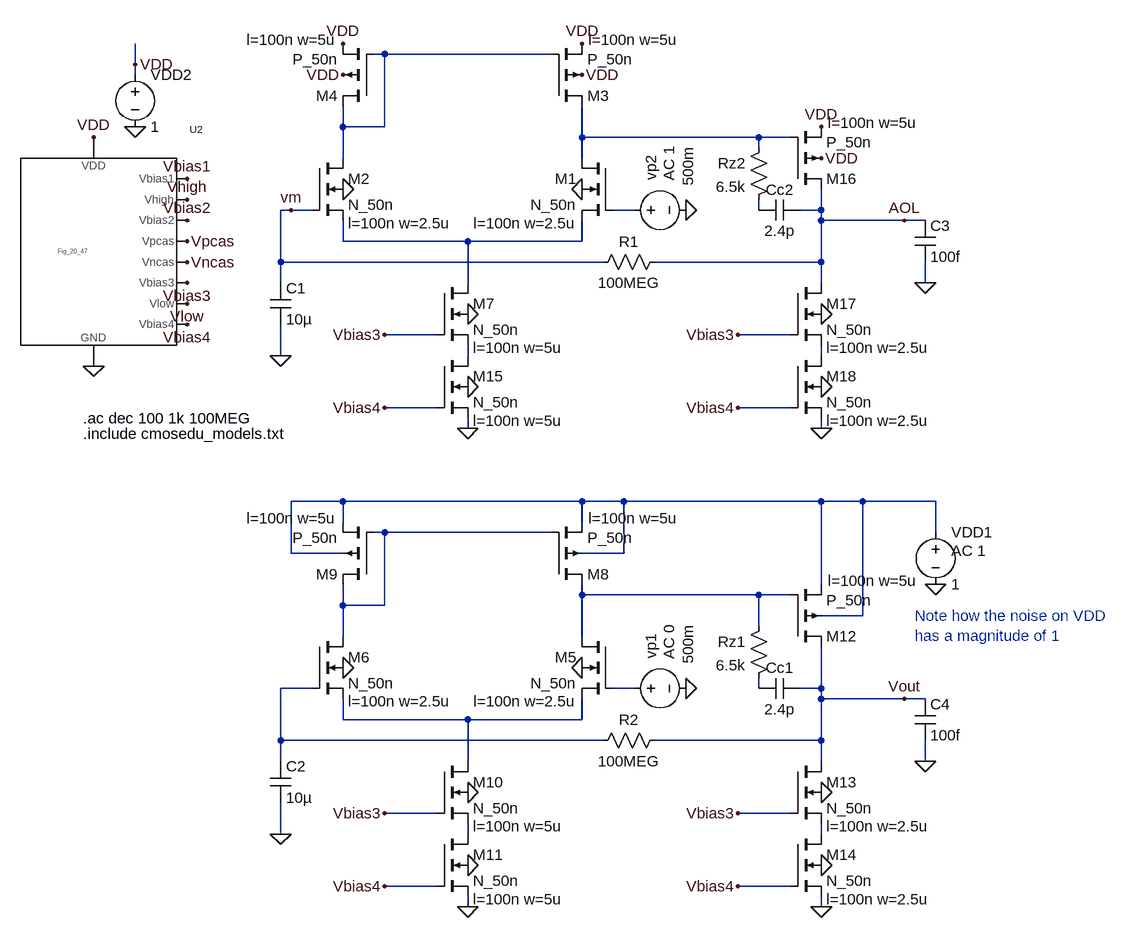
[diagram p0: schematic Fig24_27_PSRR_plus.asc]
Fig24_27_PSRR_plus.asc, the LTspice schematic file:
Version 4
SHEET 1 2512 680
WIRE 1280 -1024 1264 -1024
WIRE 1536 -1024 1280 -1024
WIRE 896 -1008 896 -1040
WIRE 896 -992 896 -1008
WIRE 1216 -912 1216 -944
WIRE 1280 -912 1280 -1024
WIRE 1280 -912 1216 -912
WIRE 1584 -896 1584 -944
WIRE 1856 -896 1584 -896
WIRE 1904 -896 1856 -896
WIRE 1856 -880 1856 -896
WIRE 1216 -864 1216 -912
WIRE 1584 -864 1584 -896
WIRE 1136 -784 1120 -784
WIRE 1168 -784 1136 -784
WIRE 1664 -784 1632 -784
WIRE 1856 -784 1856 -800
WIRE 1952 -784 1952 -816
WIRE 1952 -784 1920 -784
WIRE 1952 -768 1952 -784
WIRE 2080 -768 1952 -768
WIRE 2112 -768 2080 -768
WIRE 1216 -736 1216 -768
WIRE 1408 -736 1216 -736
WIRE 1584 -736 1584 -768
WIRE 1584 -736 1408 -736
WIRE 1120 -704 1120 -784
WIRE 1616 -704 1120 -704
WIRE 1952 -704 1952 -768
WIRE 1952 -704 1696 -704
WIRE 1120 -672 1120 -704
WIRE 1408 -672 1408 -736
WIRE 1952 -672 1952 -704
WIRE 2112 -672 2112 -704
WIRE 1360 -592 1280 -592
WIRE 1904 -592 1824 -592
WIRE 1120 -560 1120 -608
WIRE 1408 -560 1408 -576
WIRE 1952 -560 1952 -576
WIRE 1360 -480 1280 -480
WIRE 1904 -480 1824 -480
WIRE 1408 -448 1408 -464
WIRE 1952 -448 1952 -464
WIRE 1216 -336 1136 -336
WIRE 1584 -336 1216 -336
WIRE 1648 -336 1584 -336
WIRE 1952 -336 1648 -336
WIRE 2016 -336 1952 -336
WIRE 2128 -336 2016 -336
WIRE 1216 -304 1216 -336
WIRE 1584 -304 1584 -336
WIRE 1280 -288 1264 -288
WIRE 1536 -288 1280 -288
WIRE 2128 -288 2128 -336
WIRE 1136 -256 1136 -336
WIRE 1216 -256 1136 -256
WIRE 1648 -256 1648 -336
WIRE 1648 -256 1584 -256
WIRE 1952 -208 1952 -336
WIRE 1584 -192 1584 -208
WIRE 1856 -192 1584 -192
WIRE 1904 -192 1856 -192
WIRE 1216 -176 1216 -208
WIRE 1280 -176 1280 -288
WIRE 1280 -176 1216 -176
WIRE 2016 -160 2016 -336
WIRE 2016 -160 1952 -160
WIRE 1856 -144 1856 -192
WIRE 1216 -128 1216 -176
WIRE 1584 -128 1584 -192
WIRE 1168 -48 1120 -48
WIRE 1664 -48 1632 -48
WIRE 1856 -48 1856 -64
WIRE 1952 -48 1952 -112
WIRE 1952 -48 1920 -48
WIRE 1952 -32 1952 -48
WIRE 2080 -32 1952 -32
WIRE 2112 -32 2080 -32
WIRE 1216 0 1216 -32
WIRE 1408 0 1216 0
WIRE 1584 0 1584 -32
WIRE 1584 0 1408 0
WIRE 1120 32 1120 -48
WIRE 1616 32 1120 32
WIRE 1952 32 1952 -32
WIRE 1952 32 1696 32
WIRE 1120 64 1120 32
WIRE 1408 64 1408 0
WIRE 1952 64 1952 32
WIRE 2112 64 2112 32
WIRE 1360 144 1280 144
WIRE 1904 144 1824 144
WIRE 1120 176 1120 128
WIRE 1408 176 1408 160
WIRE 1952 176 1952 160
WIRE 1360 256 1280 256
WIRE 1904 256 1824 256
WIRE 1408 288 1408 272
WIRE 1952 288 1952 272
FLAG 1584 -80 0
FLAG 1408 288 0
FLAG 1216 -80 0
FLAG 1408 112 0
FLAG 1408 224 0
FLAG 1280 144 Vbias3
FLAG 1280 256 Vbias4
FLAG 1952 288 0
FLAG 1952 112 0
FLAG 1952 224 0
FLAG 1824 144 Vbias3
FLAG 1824 256 Vbias4
FLAG 2080 -32 Vout
FLAG 1120 176 0
FLAG 2112 64 0
FLAG 2128 -208 0
FLAG 1744 -48 0
FLAG 896 -912 0
FLAG 896 -1008 VDD
FLAG 1584 -816 0
FLAG 1408 -448 0
FLAG 1216 -816 0
FLAG 1584 -1040 VDD
FLAG 1584 -992 VDD
FLAG 1216 -992 VDD
FLAG 832 -896 VDD
FLAG 832 -544 0
FLAG 976 -832 Vbias1
FLAG 976 -800 Vhigh
FLAG 976 -768 Vbias2
FLAG 976 -672 Vbias3
FLAG 976 -736 Vpcas
FLAG 976 -704 Vncas
FLAG 976 -608 Vbias4
FLAG 976 -640 Vlow
FLAG 1216 -1040 VDD
FLAG 1408 -624 0
FLAG 1408 -512 0
FLAG 1280 -592 Vbias3
FLAG 1280 -480 Vbias4
FLAG 1744 -784 0
FLAG 1136 -784 vm
FLAG 1952 -912 VDD
FLAG 1952 -864 VDD
FLAG 1952 -448 0
FLAG 1952 -624 0
FLAG 1952 -512 0
FLAG 1824 -592 Vbias3
FLAG 1824 -480 Vbias4
FLAG 2080 -768 AOL
FLAG 1120 -560 0
FLAG 2112 -672 0
SYMBOL nmos4 1632 -128 M0
WINDOW 123 56 100 Left 2
SYMATTR Value2 l=100n w=2.5u
SYMATTR InstName M5
SYMATTR Value N_50n
SYMBOL nmos4 1168 -128 R0
WINDOW 123 56 100 Left 2
SYMATTR Value2 l=100n w=2.5u
SYMATTR InstName M6
SYMATTR Value N_50n
SYMBOL pmos4 1536 -208 M180
WINDOW 123 58 102 Left 2
WINDOW 0 56 16 Left 2
SYMATTR Value2 l=100n w=5u
SYMATTR InstName M8
SYMATTR Value P_50n
SYMBOL pmos4 1264 -208 R180
WINDOW 123 58 102 Left 2
WINDOW 0 56 16 Left 2
SYMATTR Value2 l=100n w=5u
SYMATTR InstName M9
SYMATTR Value P_50n
SYMBOL nmos4 1360 64 R0
WINDOW 123 56 100 Left 2
SYMATTR Value2 l=100n w=5u
SYMATTR InstName M10
SYMATTR Value N_50n
SYMBOL nmos4 1360 176 R0
WINDOW 123 56 100 Left 2
SYMATTR Value2 l=100n w=5u
SYMATTR InstName M11
SYMATTR Value N_50n
SYMBOL pmos4 1904 -112 M180
WINDOW 123 58 102 Left 2
WINDOW 0 56 16 Left 2
SYMATTR Value2 l=100n w=5u
SYMATTR InstName M12
SYMATTR Value P_50n
SYMBOL nmos4 1904 64 R0
WINDOW 123 56 100 Left 2
SYMATTR Value2 l=100n w=2.5u
SYMATTR InstName M13
SYMATTR Value N_50n
SYMBOL nmos4 1904 176 R0
WINDOW 123 56 100 Left 2
SYMATTR Value2 l=100n w=2.5u
SYMATTR InstName M14
SYMATTR Value N_50n
SYMBOL cap 1104 64 R0
SYMATTR InstName C2
SYMATTR Value 10µ
SYMBOL res 1600 48 R270
WINDOW 0 32 56 VTop 2
WINDOW 3 0 56 VBottom 2
SYMATTR InstName R2
SYMATTR Value 100MEG
SYMBOL cap 1920 -64 R90
WINDOW 0 0 32 VBottom 2
WINDOW 3 32 32 VTop 2
SYMATTR InstName Cc1
SYMATTR Value 2.4p
SYMBOL cap 2096 -32 R0
SYMATTR InstName C4
SYMATTR Value 100f
SYMBOL res 1872 -160 M0
SYMATTR InstName Rz1
SYMATTR Value 6.5k
SYMBOL voltage 2128 -304 R0
WINDOW 123 24 44 Left 2
WINDOW 39 0 0 Left 2
SYMATTR Value2 AC 1
SYMATTR InstName VDD1
SYMATTR Value 1
SYMBOL voltage 1648 -48 R270
WINDOW 0 45 42 Left 2
WINDOW 3 37 99 Left 2
WINDOW 123 45 70 Left 2
WINDOW 39 0 0 Left 2
SYMATTR InstName vp1
SYMATTR Value 500m
SYMATTR Value2 AC 0
SYMBOL voltage 896 -1008 R0
WINDOW 123 0 0 Left 2
WINDOW 39 0 0 Left 2
SYMATTR InstName VDD2
SYMATTR Value 1
SYMBOL nmos4 1632 -864 M0
WINDOW 123 56 100 Left 2
SYMATTR Value2 l=100n w=2.5u
SYMATTR InstName M1
SYMATTR Value N_50n
SYMBOL nmos4 1168 -864 R0
WINDOW 123 56 100 Left 2
SYMATTR Value2 l=100n w=2.5u
SYMATTR InstName M2
SYMATTR Value N_50n
SYMBOL pmos4 1536 -944 M180
WINDOW 123 58 102 Left 2
WINDOW 0 56 16 Left 2
SYMATTR Value2 l=100n w=5u
SYMATTR InstName M3
SYMATTR Value P_50n
SYMBOL pmos4 1264 -944 R180
WINDOW 123 58 102 Left 2
WINDOW 0 56 16 Left 2
SYMATTR Value2 l=100n w=5u
SYMATTR InstName M4
SYMATTR Value P_50n
SYMBOL Fig_20_47 832 -720 R0
SYMATTR InstName U2
SYMBOL nmos4 1360 -672 R0
WINDOW 123 56 100 Left 2
SYMATTR Value2 l=100n w=5u
SYMATTR InstName M7
SYMATTR Value N_50n
SYMBOL nmos4 1360 -560 R0
WINDOW 123 56 100 Left 2
SYMATTR Value2 l=100n w=5u
SYMATTR InstName M15
SYMATTR Value N_50n
SYMBOL voltage 1648 -784 R270
WINDOW 0 45 42 Left 2
WINDOW 3 37 99 Left 2
WINDOW 123 45 70 Left 2
WINDOW 39 0 0 Left 2
SYMATTR InstName vp2
SYMATTR Value 500m
SYMATTR Value2 AC 1
SYMBOL pmos4 1904 -816 M180
WINDOW 123 58 102 Left 2
WINDOW 0 56 16 Left 2
SYMATTR Value2 l=100n w=5u
SYMATTR InstName M16
SYMATTR Value P_50n
SYMBOL nmos4 1904 -672 R0
WINDOW 123 56 100 Left 2
SYMATTR Value2 l=100n w=2.5u
SYMATTR InstName M17
SYMATTR Value N_50n
SYMBOL nmos4 1904 -560 R0
WINDOW 123 56 100 Left 2
SYMATTR Value2 l=100n w=2.5u
SYMATTR InstName M18
SYMATTR Value N_50n
SYMBOL cap 1104 -672 R0
SYMATTR InstName C1
SYMATTR Value 10µ
SYMBOL res 1600 -688 R270
WINDOW 0 32 56 VTop 2
WINDOW 3 0 56 VBottom 2
SYMATTR InstName R1
SYMATTR Value 100MEG
SYMBOL cap 1920 -800 R90
WINDOW 0 0 32 VBottom 2
WINDOW 3 32 32 VTop 2
SYMATTR InstName Cc2
SYMATTR Value 2.4p
SYMBOL cap 2096 -768 R0
SYMATTR InstName C3
SYMATTR Value 100f
SYMBOL res 1872 -896 M0
SYMATTR InstName Rz2
SYMATTR Value 6.5k
TEXT 2096 -160 Left 2 ;Note how the noise on VDD\nhas a magnitude of 1
TEXT 816 -440 Left 2 !.include cmosedu_models.txt
TEXT 816 -464 Left 2 !.ac dec 100 1k 100MEG

The netlist it stands for:
* Fig24_27_PSRR_plus.asc
M5 N010 N012 N014 0 N_50n l=100n w=2.5u
M6 N009 N011 N014 0 N_50n l=100n w=2.5u
M8 N010 N009 N008 N008 P_50n l=100n w=5u
M9 N009 N009 N008 N008 P_50n l=100n w=5u
M10 N014 Vbias3 N015 0 N_50n l=100n w=5u
M11 N015 Vbias4 0 0 N_50n l=100n w=5u
M12 Vout N010 N008 N008 P_50n l=100n w=5u
M13 Vout Vbias3 N016 0 N_50n l=100n w=2.5u
M14 N016 Vbias4 0 0 N_50n l=100n w=2.5u
C2 N011 0 10µ
R2 N011 Vout 100MEG
Cc1 Vout N013 2.4p
C4 Vout 0 100f
Rz1 N010 N013 6.5k
VDD1 N008 0 1 AC 1
vp1 N012 0 500m AC 0
VDD2 VDD 0 1
M1 N002 N003 N005 0 N_50n l=100n w=2.5u
M2 N001 vm N005 0 N_50n l=100n w=2.5u
M3 N002 N001 VDD VDD P_50n l=100n w=5u
M4 N001 N001 VDD VDD P_50n l=100n w=5u
XU2 Vbias1 Vhigh Vbias2 Vpcas Vncas Vbias3 Vlow Vbias4 VDD 0 Fig_20_47  ; pins Vbias1 Vhigh Vbias2 Vpcas Vncas Vbias3 Vlow Vbias4 VDD GND
M7 N005 Vbias3 N006 0 N_50n l=100n w=5u
M15 N006 Vbias4 0 0 N_50n l=100n w=5u
vp2 N003 0 500m AC 1
M16 AOL N002 VDD VDD P_50n l=100n w=5u
M17 AOL Vbias3 N007 0 N_50n l=100n w=2.5u
M18 N007 Vbias4 0 0 N_50n l=100n w=2.5u
C1 vm 0 10µ
R1 vm AOL 100MEG
Cc2 AOL N004 2.4p
C3 AOL 0 100f
Rz2 N002 N004 6.5k
.model NMOS NMOS
.model PMOS PMOS
.lib standard.mos
* Note how the noise on VDD
* has a magnitude of 1
.include cmosedu_models.txt
.ac dec 100 1k 100MEG
.backanno
.end